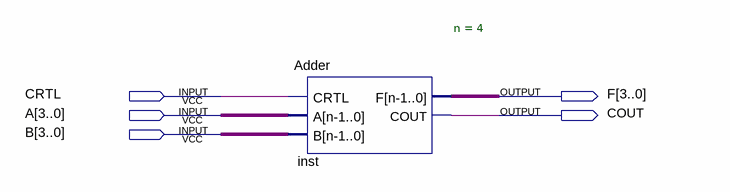
[diagram p0: schematic sheet]
// Quartus schematic adder-schematic.bdf as structural Verilog: 1 symbols, 5 pins
module \adder-schematic  (
  input  CRTL,
  input  [3:0] A,
  input  [3:0] B,
  output [3:0] F,
  output COUT
);

  Adder #(.n(4)) inst (.CRTL(CRTL), .A(A), .B(B), .F(F), .COUT(COUT));
endmodule
